# Altium project RfestPCB2.PrjPcb
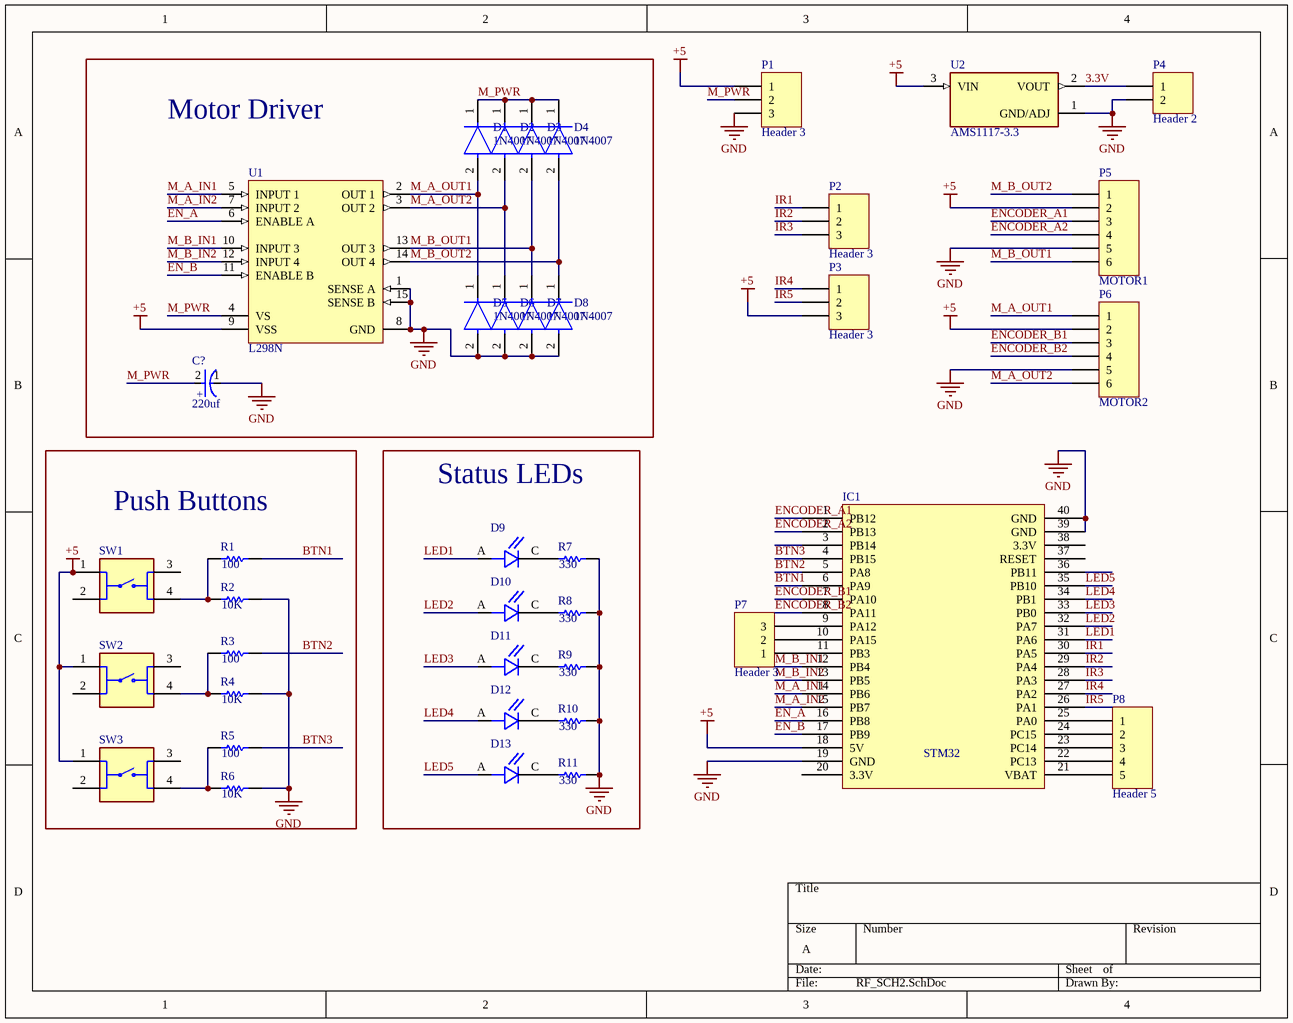
[diagram p0: RF_SCH2.SchDoc]
1 sheet, 39 parts. Net scope: global (net labels, ports and power ports of the same name join across sheets).
Board file: RF_PCB2.PcbDoc

## Sheet RF_SCH2.SchDoc
size A

### Parts
C?  220uf  [FP-RAD-TH-D_6_3_0_5-L_11-MFG]
D1  1N4007  [FP-1N4007-MFG]
D2  1N4007  [FP-1N4007-MFG]
D3  1N4007  [FP-1N4007-MFG]
D4  1N4007  [FP-1N4007-MFG]
D5  1N4007  [FP-1N4007-MFG]
D6  1N4007  [FP-1N4007-MFG]
D7  1N4007  [FP-1N4007-MFG]
D8  1N4007  [FP-1N4007-MFG]
D9  OVLAW4CB7  [LEDRD254W50D305H520P]  (value not drawn)
D10  OVLAW4CB7  [LEDRD254W50D305H520P]  (value not drawn)
D11  OVLAW4CB7  [LEDRD254W50D305H520P]  (value not drawn)
D12  OVLAW4CB7  [LEDRD254W50D305H520P]  (value not drawn)
D13  OVLAW4CB7  [LEDRD254W50D305H520P]  (value not drawn)
IC1  STM32  [PCBComponent_1]
P1  Header 3  [HDR1X3]
P2  Header 3  [HDR1X3]
P3  Header 3  [HDR1X3]
P4  Header 2  [HDR1X2]
P5  MOTOR1  [HDR1X6]
P6  MOTOR2  [HDR1X6]
P7  Header 3  [HDR1X3]
P8  Header 5  [HDR1X5]
R1  value 100  [AXIAL-0.3]  (hidden comment: Res1)
R2  value 10K  [AXIAL-0.3]  (hidden comment: Res1)
R3  value 100  [AXIAL-0.3]  (hidden comment: Res1)
R4  value 10K  [AXIAL-0.3]  (hidden comment: Res1)
R5  value 100  [AXIAL-0.3]  (hidden comment: Res1)
R6  value 10K  [AXIAL-0.3]  (hidden comment: Res1)
R7  value 330  [AXIAL-0.3]  (hidden comment: Res1)
R8  value 330  [AXIAL-0.3]  (hidden comment: Res1)
R9  value 330  [AXIAL-0.3]  (hidden comment: Res1)
R10  value 330  [AXIAL-0.3]  (hidden comment: Res1)
R11  value 330  [AXIAL-0.3]  (hidden comment: Res1)
SW1  1825910-2  [TE_1825910-2]  (value not drawn)
SW2  1825910-2  [TE_1825910-2]  (value not drawn)
SW3  1825910-2  [TE_1825910-2]  (value not drawn)
U1  L298N  [STM-FM-15]
U2  AMS1117-3.3  [SOT229P700X180-4N]

### Blocks framed on the sheet
Motor Driver: C? D1-D8 U1
Push Buttons: R1-R6 SW1-SW3
Status LEDs: D9-D13 R7-R11

### Nets
+5: IC1.18(5V) P1.1 P3.3 P5.2 P6.2 SW1.1 SW2.1 SW3.1 U1.9(VSS) U2.3(VIN)
GND: C?.1(C) D5.2(A) D6.2(A) D7.2(A) D8.2(A) IC1.19(GND) IC1.39(GND) IC1.40(GND) P1.3 P4.2 P5.5 P6.5 R2.2 R4.2 R6.2 R7.2 R8.2 R9.2 R10.2 R11.2 U1.1(SENSE_A) U1.8(GND) U1.15(SENSE_B) U2.1(GND/ADJ)
3.3V: P4.1 U2.2(VOUT)
BTN1: IC1.6(PA9) R1.2
BTN2: IC1.5(PA8) R3.2
BTN3: IC1.4(PB15) R5.2
EN_A: IC1.16(PB8) U1.6(ENABLE_A)
EN_B: IC1.17(PB9) U1.11(ENABLE_B)
ENCODER_A1: IC1.1(PB12) P5.3
ENCODER_A2: IC1.2(PB13) P5.4
ENCODER_B1: IC1.7(PA10) P6.3
ENCODER_B2: IC1.8(PA11) P6.4
IR1: IC1.30(PA5) P2.1
IR2: IC1.29(PA4) P2.2
IR3: IC1.28(PA3) P2.3
IR4: IC1.27(PA2) P3.1
IR5: IC1.26(PA1) P3.2
LED1: D9.A IC1.31(PA6)
LED2: D10.A IC1.32(PA7)
LED3: D11.A IC1.33(PB0)
LED4: D12.A IC1.34(PB1)
LED5: D13.A IC1.35(PB10)
M_A_IN1: IC1.14(PB6) U1.5(INPUT_1)
M_A_IN2: IC1.15(PB7) U1.7(INPUT_2)
M_A_OUT1: D1.2(A) D5.1(C) P6.1 U1.2(OUT_1)
M_A_OUT2: D2.2(A) D6.1(C) P6.6 U1.3(OUT_2)
M_B_IN1: IC1.12(PB4) U1.10(INPUT_3)
M_B_IN2: IC1.13(PB5) U1.12(INPUT_4)
M_B_OUT1: D3.2(A) D7.1(C) P5.6 U1.13(OUT_3)
M_B_OUT2: D4.2(A) D8.1(C) P5.1 U1.14(OUT_4)
M_PWR: C?.2(A) D1.1(C) D2.1(C) D3.1(C) D4.1(C) P1.2 U1.4(VS)
NetD9_C: D9.C R7.1
NetD10_C: D10.C R8.1
NetD11_C: D11.C R9.1
NetD12_C: D12.C R10.1
NetD13_C: D13.C R11.1
NetIC1_9: IC1.9(PA12) P7.3
NetIC1_10: IC1.10(PA15) P7.2
NetIC1_11: IC1.11(PB3) P7.1
NetIC1_21: IC1.21(VBAT) P8.5
NetIC1_22: IC1.22(PC13) P8.4
NetIC1_23: IC1.23(PC14) P8.3
NetIC1_24: IC1.24(PC15) P8.2
NetIC1_25: IC1.25(PA0) P8.1
NetR1_1: R1.1 R2.1 SW1.4
NetR3_1: R3.1 R4.1 SW2.4
NetR5_1: R5.1 R6.1 SW3.4

Not connected (* = marked no-connect by the designer): IC1 3(PB14) 20(3.3V) 36(PB11) 37(RESET) 38(3.3V); SW1 2 3; SW2 2 3; SW3 2 3

### Notes on the sheet
- (in symbol CMP-05427-000685-1) +

### Library data of the parts
C? = CMP-05427-000685-1: Aluminum Electrolytic Capacitors (Radial Lead Type) AEC-Q200 Qualified 220uF ±20% 16V; Ripple Current: 180mA; Lead/Base Style: Straight; Life (Hours): 1000Hour; Lead Diameter: 0.5mm; Mount: Through Hole; Lead Pitch: 5mm; Case/Package: Radial; Min Operating Temperature: -55°C; Height - Seated (Max): 0.48inch; RoHS Compliant: Yes; Radiation Hardening: No; Tolerance: 20%; Packaging: Ammo Pack; Voltage Rating: 16V; Voltage Rating (DC): 16V; Max Operating Temperature: 105°C; Series: NHG; Package Quantity: 2000; Height: 11.2mm; Termination: Radial; Length: 11.2mm; Capacitance: 220uF; Diameter: 6.3mm
D1-D8 = CMP-123542-000001-1: Rectifier diode 1000 V 1 A DO-41, ,; Manufacturer: Diotec; Max Surge Forward Current: 27A; Forward Current: 1A; Max Junction Temp: +175°C; Reverse Voltage: 1000V; Value: 15pF; Peak Reverse Current: 5uA; Category: Diode; Temperature Range Low: -50°C; Automotive: No; Temperature: -50°C to +175°C; Lead Free: Yes; ComponentLink2Description: Datasheet; Max Repetitive Reverse Voltage: 1000V; ComponentLink2URL: https://datasheet.octopart.com/1N4007-Diotec-datasheet-62346875.pdf; Manufacturer Part Number: 1N4007; Device Class L3: Rectifier Diodes; Height: 2.8mm; Octopart: https://octopart.com/1n4007-diotec-4040411; Package: 1N4007; Temperature Range High: +175°C; Device Class L1: Discrete Semiconductors; Device Class L2: Diodes; RoHS: TRUE; Capacitance: 15pF; Ipc Land Pattern Name: DIOAD888W100L520D280
D9-D13 = OVLAW4CB7: White LED Indication - Discrete 3.2V Radial; MF: TT Electronics/Optek; Value: *; SnapEDA_Link: https://www.snapeda.com/parts/OVLAW4CB7/TT%20Electronics/Optek%20Technology/view-part/328075/?ref=snap; Availability: Unavailable; Package: Radial Optek; Price: None; MP: OVLAW4CB7
IC1 = Component_1
P1-P3 P7 = Header 3: Header, 3-Pin; LatestRevisionDate: 17-Jul-2002; LatestRevisionNote: Re-released for DXP Platform.; Publisher: Altium Limited
P4 = Header 2: Header, 2-Pin; LatestRevisionDate: 17-Jul-2002; LatestRevisionNote: Re-released for DXP Platform.; Publisher: Altium Limited
P5 P6 = Header 6: Header, 6-Pin; LatestRevisionDate: 17-Jul-2002; LatestRevisionNote: Re-released for DXP Platform.; Publisher: Altium Limited
P8 = Header 5: Header, 5-Pin; LatestRevisionDate: 17-Jul-2002; LatestRevisionNote: Re-released for DXP Platform.; Publisher: Altium Limited
R1-R11 = Res1: Resistor; Published: 8-Jun-2000; LatestRevisionDate: 17-Jul-2002; LatestRevisionNote: Re-released for DXP Platform.; PackageReference: AXIAL-0.3; Publisher: Altium Limited; PackageDescription: Axial Device, Thru-Hole; 2 Leads; 0.3 in Pin Spacing
SW1-SW3 = 1825910-2: 50 mA SPST Round Actuator 160 Gram Force Tactile Pushbutton Switch; MF: TE Connectivity; Check_prices: https://www.snapeda.com/parts/1825910-2/TE+Connectivity+ALCOSWITCH+Switches/view-part/?ref=eda; Value: *; Availability: In Stock; MP: 1825910-2; Price: None; Package: None; SnapEDA_Link: https://www.snapeda.com/parts/1825910-2/TE+Connectivity+ALCOSWITCH+Switches/view-part/?ref=snap; Purchase-URL: https://pricing.snapeda.com/search/part/1825910-2/?ref=eda; EU_RoHS_Compliance: Compliant
U1 = CMP-2000-06526-1: Dual Full-Bridge Driver, 4.8 to 46 V, -40 to 150 degC, 15-Pin FM (MW 15L), RoHS, Tube; Manufacturer: STMicroelectronics; PartNumber: L298; Output Current: 2A; Supply Voltage Max: 7V; Driver Case Style: Multiwatt; Supply Voltage Min: 4.5V; No. of Pins: 15Pins; SVHC: NoSVHC(17-Dec-2015); Output Voltage: 46V; No. of Outputs: 4Outputs; Motor Type: FullBridge; MSL: -; Package Description: 15-Pin Flange Mount, Body 5 x 19.6 mm, Pitch 1.27 mm; Datasheet Version: 01/2000; Package Reference: FM-15; Mounting Technology: ThroughHole; Packaging: Each; Automotive Qualification Standard: -; Product Range: -; Datasheet URL: https://datasheet.ciiva.com/15109/getdatasheetpartid-50682-15109332.pdf; Operating Temperature Max: 130°C; Operating Temperature Min: -25°C; Manufacturer URL: http://www.st.com/
U2 = AMS1117-3.3: Sot223/Pkg 1-Amp 3.3-Volt Low Drop Out Voltage Regulatator; MF: Advanced Monolithic Systems; Package: SOT-223 Seeed Technology; Value: *; Check_prices: https://www.snapeda.com/parts/AMS1117-3.3/Advanced+Monolithic+Systems/view-part/?ref=eda; Price: None; Availability: Not in stock; MP: AMS1117-3.3; SnapEDA_Link: https://www.snapeda.com/parts/AMS1117-3.3/Advanced+Monolithic+Systems/view-part/?ref=snap